# EAGLE schematic EVAA slave (EAGLE 9.5.0)
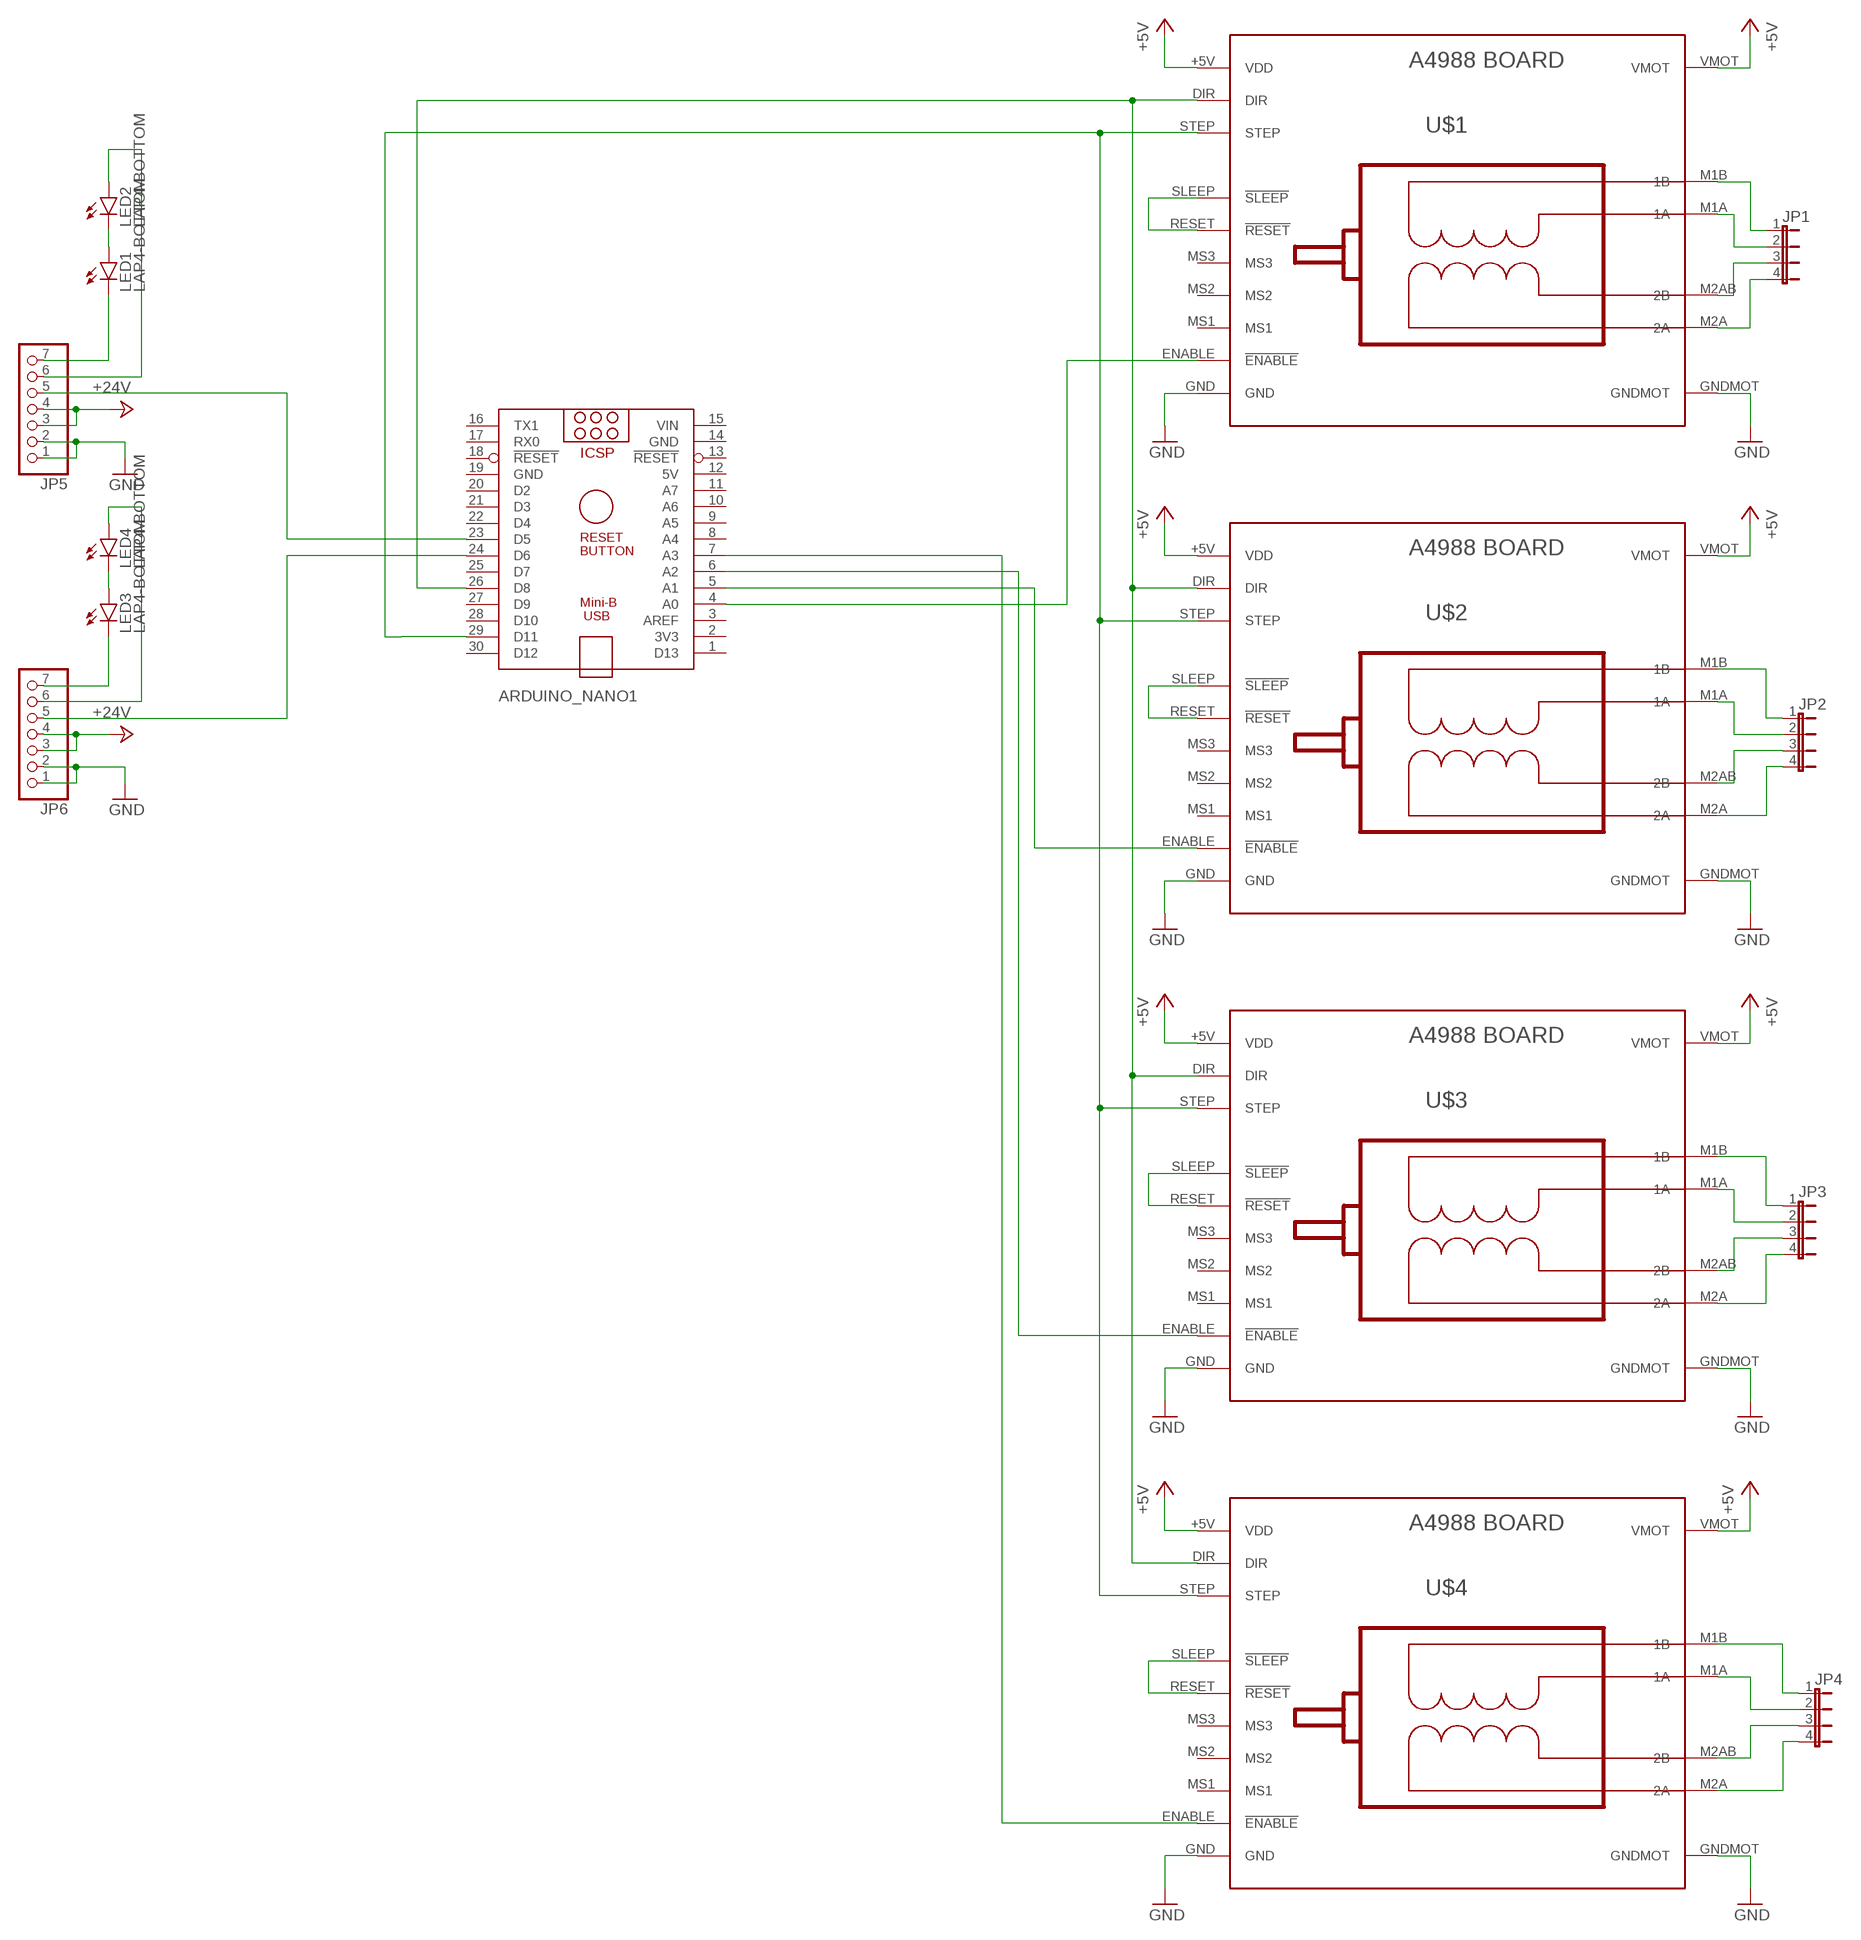
[diagram p0: schematic, sheet 1]

## Parts
ARDUINO_NANO1  ARDUINO_NANO  [ARDUINO_NANO]
JP1  JP4E  [JP4]
JP2  JP4E  [JP4]
JP3  JP4E  [JP4]
JP4  JP4E  [JP4]
JP5  PINHD-1X7/90  [1X07/90]
JP6  PINHD-1X7/90  [1X07/90]
LED1  LAP4-BOTTOM  [P47F-BOTTOM]
LED2  LAP4-BOTTOM  [P47F-BOTTOM]
LED3  LAP4-BOTTOM  [P47F-BOTTOM]
LED4  LAP4-BOTTOM  [P47F-BOTTOM]
U$1  BOARD_A4988  [BOARD_A4988]
U$2  BOARD_A4988  [BOARD_A4988]
U$3  BOARD_A4988  [BOARD_A4988]
U$4  BOARD_A4988  [BOARD_A4988]

## Nets
+5V: U$1.+5V(VDD) U$1.VMOT U$2.+5V(VDD) U$2.VMOT U$3.+5V(VDD) U$3.VMOT U$4.+5V(VDD) U$4.VMOT
+24V: JP5.3 JP5.4 JP6.3 JP6.4
GND: JP5.1 JP5.2 JP6.1 JP6.2 U$1.GND U$1.GNDMOT U$2.GND U$2.GNDMOT U$3.GND U$3.GNDMOT U$4.GND U$4.GNDMOT
N$1: ARDUINO_NANO1.26(D8) U$1.DIR U$2.DIR U$3.DIR U$4.DIR
N$2: ARDUINO_NANO1.4(A0) U$1.ENABLE(!ENABLE)
N$3: ARDUINO_NANO1.5(A1) U$2.ENABLE(!ENABLE)
N$4: ARDUINO_NANO1.29(D11) U$1.STEP U$2.STEP U$3.STEP U$4.STEP
N$5: ARDUINO_NANO1.6(A2) U$3.ENABLE(!ENABLE)
N$6: ARDUINO_NANO1.7(A3) U$4.ENABLE(!ENABLE)
N$7: U$1.RESET(!RESET) U$1.SLEEP(!SLEEP)
N$8: U$2.RESET(!RESET) U$2.SLEEP(!SLEEP)
N$9: U$3.RESET(!RESET) U$3.SLEEP(!SLEEP)
N$10: U$4.RESET(!RESET) U$4.SLEEP(!SLEEP)
N$11: JP4.2 U$4.M1A(1A)
N$12: JP4.3 U$4.M2AB(2B)
N$13: JP4.4 U$4.M2A(2A)
N$14: JP4.1 U$4.M1B(1B)
N$15: JP3.4 U$3.M2A(2A)
N$16: JP3.1 U$3.M1B(1B)
N$17: JP3.2 U$3.M1A(1A)
N$18: JP3.3 U$3.M2AB(2B)
N$19: JP2.4 U$2.M2A(2A)
N$20: JP2.1 U$2.M1B(1B)
N$21: JP2.2 U$2.M1A(1A)
N$22: JP2.3 U$2.M2AB(2B)
N$23: ARDUINO_NANO1.23(D5) JP5.5
N$24: ARDUINO_NANO1.24(D6) JP6.5
N$25: JP5.7 LED1.C
N$26: JP5.6 LED2.A
N$27: JP6.7 LED3.C
N$28: LED3.A LED4.C
N$29: JP6.6 LED4.A
N$30: LED1.A LED2.C
N$31: JP1.2 U$1.M1A(1A)
N$32: JP1.3 U$1.M2AB(2B)
N$33: JP1.4 U$1.M2A(2A)
N$34: JP1.1 U$1.M1B(1B)
Unconnected: ARDUINO_NANO1.1(D13) ARDUINO_NANO1.2(3V3) ARDUINO_NANO1.3(AREF) ARDUINO_NANO1.8(A4) ARDUINO_NANO1.9(A5) ARDUINO_NANO1.10(A6) ARDUINO_NANO1.11(A7) ARDUINO_NANO1.13(!RESET) ARDUINO_NANO1.16(TX1) ARDUINO_NANO1.17(RX0) ARDUINO_NANO1.18(!RESET) ARDUINO_NANO1.20(D2) ARDUINO_NANO1.21(D3) ARDUINO_NANO1.22(D4) ARDUINO_NANO1.25(D7) ARDUINO_NANO1.27(D9) ARDUINO_NANO1.28(D10) ARDUINO_NANO1.30(D12) U$1.MS1 U$1.MS2 U$1.MS3 U$2.MS1 U$2.MS2 U$2.MS3 U$3.MS1 U$3.MS2 U$3.MS3 U$4.MS1 U$4.MS2 U$4.MS3

## Power pins joined to a net without a drawn wire
5V: ARDUINO_NANO1.12(5V)
GND: ARDUINO_NANO1.14(GND) ARDUINO_NANO1.19(GND)
VIN: ARDUINO_NANO1.15(VIN)

## Library data of the parts
ARDUINO_NANO1 = ArduinoNanoV30:ARDUINO_NANO: Arduino Nano V3.0 Overview: The Arduino Nano is a small, complete, and breadboard-friendly board based on the ATmega328 (Arduino Nano 3.x) or ATmega168 (Arduino Nano 2.x). It has more or less the same functionality of the Arduino Duemilanove, but in a different package. It lacks only a DC power jack, and works with a Mini-B USB cable instead of a standard one. The Nano was designed and is being produced by Gravitech. Specifications: Microcontroller Atmel ATmega168 or ATmega328 Operating Voltage (logic level) 5 V Input Voltage (recommended) 7-12 V Input Voltage (limits) 6-20 V Digital I/O Pins 14 (of which 6 provide PWM output) Analog Input Pins 8 DC Current per I/O Pin 40 mA Flash Memory 16 KB (ATmega168) or 32 KB (ATmega328) of which 2 KB used by bootloader SRAM 1 KB (ATmega168) or 2 KB (ATmega328) EEPROM 512 bytes (ATmega168) or 1 KB (ATmega328) Clock Speed 16 MHz Dimensions 0.73" x 1.70" Length 45 mm Width 18 mm Weigth 5 g Power: The Arduino Nano can be powered via the Mini-B USB connection, 6-20V unregulated external power supply (pin 30), or 5V regulated external power supply (pin 27). The power source is automatically selected to the highest voltage source. Memory: The ATmega168 has 16 KB of flash memory for storing code (of which 2 KB is used for the bootloader); the ATmega328 has 32 KB, (also with 2 KB used for the bootloader). The ATmega168 has 1 KB of SRAM and 512 bytes of EEPROM (which can be read and written with the EEPROM library); the ATmega328 has 2 KB of SRAM and 1 KB of EEPROM. Input and Output: Each of the 14 digital pins on the Nano can be used as an input or output, using pinMode(), digitalWrite(), and digitalRead() functions. They operate at 5 volts. Each pin can provide or receive a maximum of 40 mA and has an internal pull-up resistor (disconnected by default) of 20-50 kOhms. In addition, some pins have specialized functions. Visit Arduino - ArduinoBoardNano <https://www.arduino.cc/en/Main/ArduinoBoardNano>
JP1-JP4 = jumper:JP4E: JUMPER
JP5 JP6 = pinhead:PINHD-1X7: PIN HEADER
LED1-LED4 = led:*P4: PointLED® Enhanced Thinfilm LED TOP & BOTTOM mount LS P47F, LR P47F, LA P47F, LY P47F, LT P4SG, LB P4SG, LW P4SG Source: http://catalog.osram-os.com .. LA_LR_LS_LY_P47F_Pb_free.pdf
U$1-U$4 = Clean-Kong:BOARD_A4988